# EAGLE design rpi-mcp3008 (EAGLE 6.5.0)
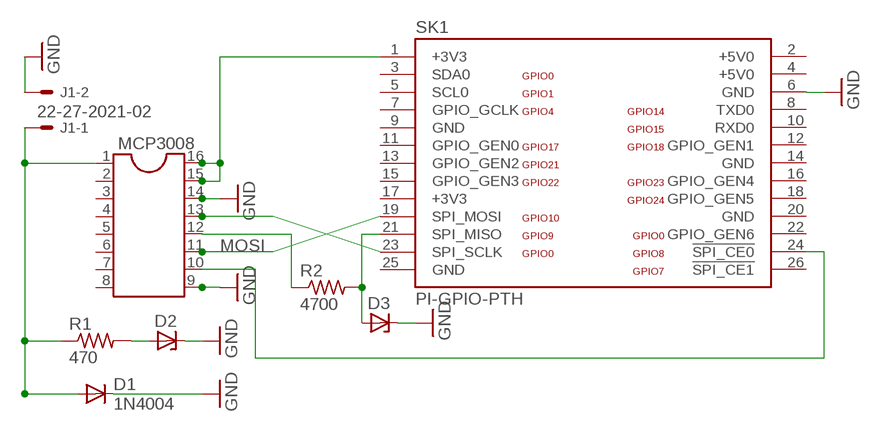
[diagram p0: schematic, sheet 1]

## Parts
D1  1N4004  [DO41-10]
D2  ZENER-DIODEP1-Z12  [P1Z12]
D3  ZENER-DIODEP1-Z12  [P1Z12]
J1  22-27-2021-02  [6410-02]
MCP3008  DIL16  [DIL16]
R1  470  R-US_0207/7  [0207/7]
R2  4700  R-US_0207/7  [0207/7]
SK1  PI-GPIO-PTH  [GPIO-CONNECTOR]

## Nets
GND: D1.C D2.C D3.C J1.2 MCP3008.9 MCP3008.14 SK1.6(GND)
MOSI: MCP3008.11 SK1.19(SPI_MOSI)
N$2: D1.A J1.1 MCP3008.1 R1.1
N$4: MCP3008.15 MCP3008.16 SK1.1(+3V3)
N$7: MCP3008.10 SK1.24(!SPI_CE0)
N$11: D2.A R1.2
N$13: MCP3008.12 R2.1
N$14: D3.A R2.2 SK1.21(SPI_MISO)
SCLK: MCP3008.13 SK1.23(SPI_SCLK)
Unconnected: MCP3008.2 MCP3008.3 MCP3008.4 MCP3008.5 MCP3008.6 MCP3008.7 MCP3008.8 SK1.3(SDA0) SK1.5(SCL0) SK1.7(GPIO_GCLK) SK1.8(TXD0) SK1.10(RXD0) SK1.11(GPIO_GEN0) SK1.12(GPIO_GEN1) SK1.13(GPIO_GEN2) SK1.15(GPIO_GEN3) SK1.16(GPIO_GEN4) SK1.18(GPIO_GEN5) SK1.22(GPIO_GEN6) SK1.26(!SPI_CE1)

## Power pins joined to a net without a drawn wire
+3V3: SK1.17(+3V3)
+5V0: SK1.2(+5V0) SK1.4(+5V0)
GND: SK1.9(GND) SK1.14(GND) SK1.20(GND) SK1.25(GND)

## Library data of the parts
D1 = diode:1N4004: DIODE general purpose rectifier, 1 A
D2 D3 = diode:ZENER-DIODE: Z-Diode
J1 = con-molex:22-?-02: CONNECTOR wire to board 2.54 mm (.1 inch) pitch header; OC_FARNELL: unknown; OC_NEWARK: unknown
MCP3008 = ic-package:DIL16: Dual In Line / Socket
R1 R2 = resistor:R-US_: RESISTOR, American symbol
SK1 = jt-raspberry-pi:PI-: Raspberry Pi

## Net classes
0 default: width 1.016 mm, clearance 0.355 mm
1 power: width 1 mm, clearance 0.355 mm to class 0, clearance 0.355 mm

## Board
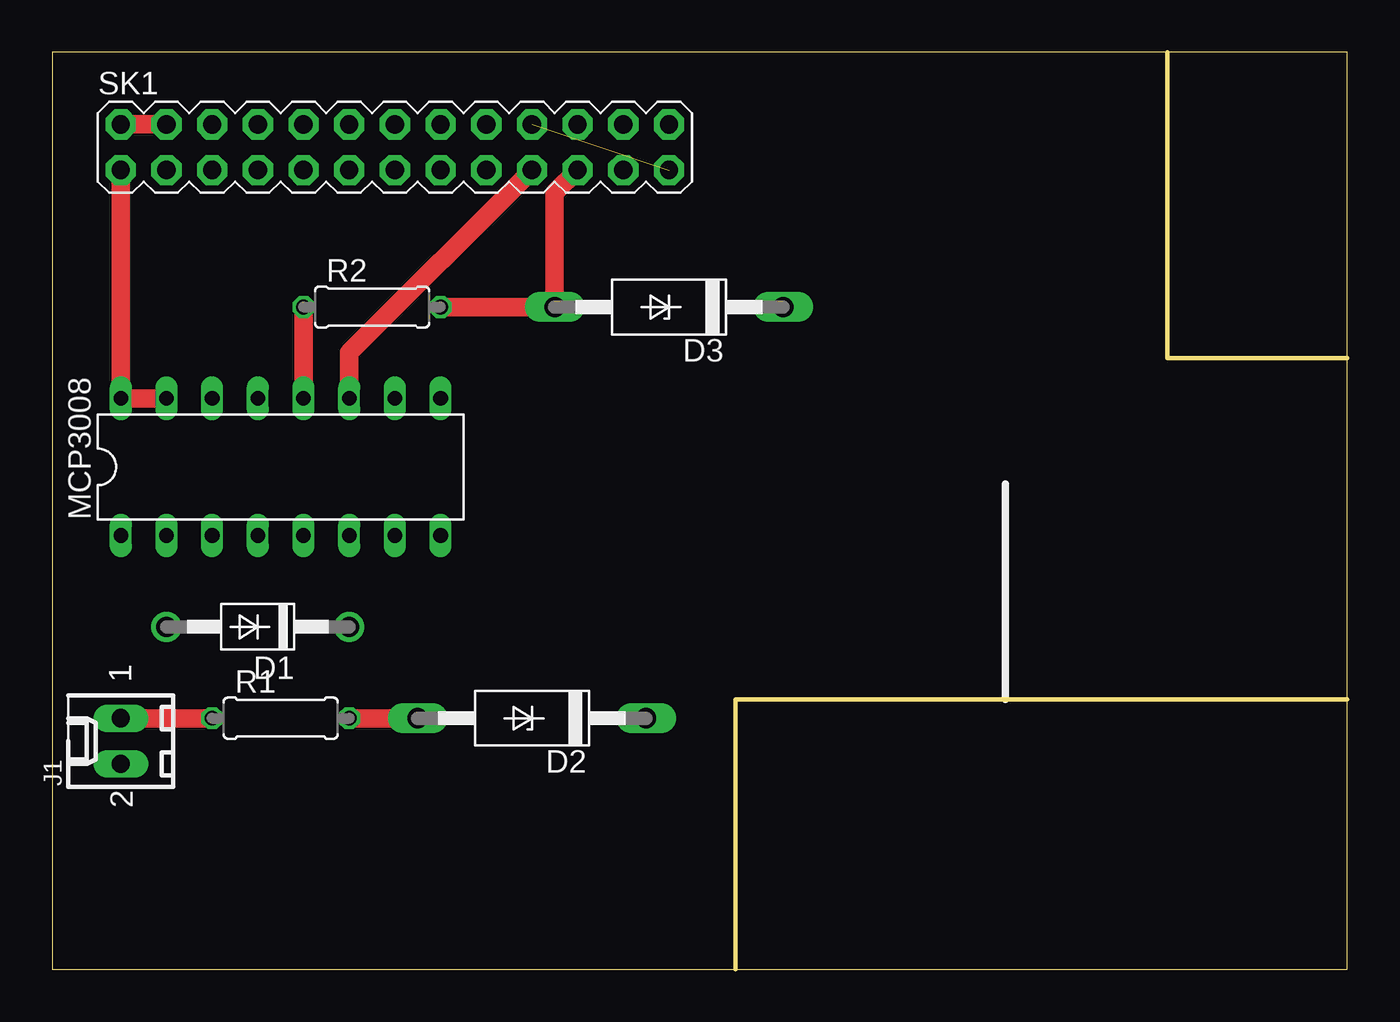
[diagram p1: board, top side]
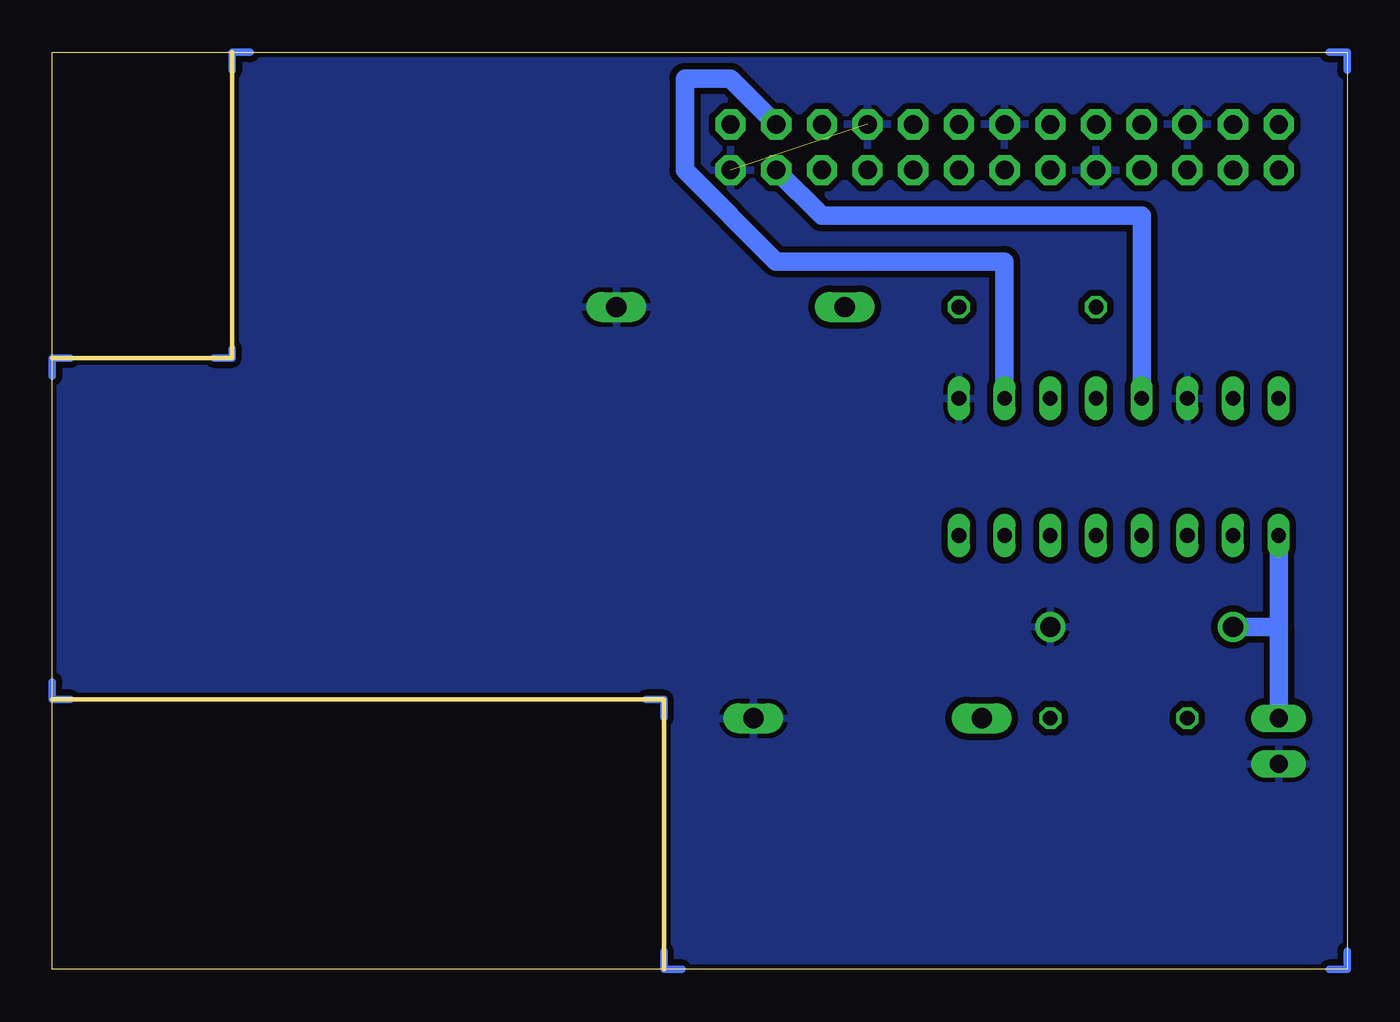
[diagram p2: board, bottom side, seen from below]

Size 72 x 51 mm. Coordinates in mm from the lower left corner, seen from the top.
Outline: 38,0 72,0 72,15
Outline: 72,15 72,34
Outline: 72,34 72,51 62,51
Outline: 62,51 0,51 0,0 38,0
Outline: 62,51 62,34 72,34
Outline: 38,0 38,15 72,15
Copper layers (1*2*15*16): Top 0.035mm / dielectric 0.2mm / layer 2 0.0175mm / dielectric 1.1mm / layer 15 0.0175mm / dielectric 0.2mm / Bottom 0.035mm
Design rules "SeeedStudio_DRU_no_angle_20130527": minimum track width 6mil, minimum drill 12mil, track to track 6mil, track to pad 6mil, pad to pad 6mil, via to via 6mil, smd to smd 0mil, copper to edge 10mil, drill to drill 10mil, minimum pad ring 6mil, minimum via ring 6mil, stop-mask expansion 2mil, vias tented up to drill 25mil, thermal gap 10mil

### Footprints (pad centres in the part's own frame; a part is rotated, then mirrored left to right if it is on the bottom)
DO41-10 = drill 1.118: A 5.08,0; C -5.08,0
P1Z12 = drill 1.118 long: A 6.35,0; C -6.35,0
6410-02 = drill 1.016 long: 1 1.27,0; 2 -1.27,0
DIL16 = drill 0.813 long: 1 -8.89,-3.81; 2 -6.35,-3.81; 3 -3.81,-3.81; 4 -1.27,-3.81; 5 1.27,-3.81; 6 3.81,-3.81; 7 6.35,-3.81; 8 8.89,-3.81; 9 8.89,3.81; 10 6.35,3.81; 11 3.81,3.81; 12 1.27,3.81; 13 -1.27,3.81; 14 -3.81,3.81; 15 -6.35,3.81; 16 -8.89,3.81
0207/7 = drill 0.813 octagon: 1 -3.81,0; 2 3.81,0
GPIO-CONNECTOR = drill 1.016 pad 1.676 octagon: 1 -15.24,-1.27; 2 -15.24,1.27; 3 -12.7,-1.27; 4 -12.7,1.27; 5 -10.16,-1.27; 6 -10.16,1.27; 7 -7.62,-1.27; 8 -7.62,1.27; 9 -5.08,-1.27; 10 -5.08,1.27; 11 -2.54,-1.27; 12 -2.54,1.27; 13 0,-1.27; 14 0,1.27; 15 2.54,-1.27; 16 2.54,1.27; 17 5.08,-1.27; 18 5.08,1.27; 19 7.62,-1.27; 20 7.62,1.27; 21 10.16,-1.27; 22 10.16,1.27; 23 12.7,-1.27; 24 12.7,1.27; 25 15.24,-1.27; 26 15.24,1.27

### Placement (x,y rotation side)
D1  11.43,19.05 180 top
D2  26.67,13.97 180 top
D3  34.29,36.83 180 top
J1  3.81,12.7 90 top
MCP3008  12.7,27.94 0 top
R1  12.7,13.97 0 top
R2  17.78,36.83 0 top
SK1  19.05,45.72 0 top

### Tracks (layer width: path | path; a pad name or v marks a point on that pad's centre or on a via)
+5V0
  Top 1.016: SK1.4 SK1.2
GND  (1 unrouted)
  pour Bottom: -2.54,53.34 74.93,53.34 74.93,-2.54 -2.54,-2.54
MOSI
  Top 1.016: MCP3008.11 16.51,34.29 SK1.19
N$1
  Bottom 0.406: 1,51 0,51 0,50
N$2
  Top 1.016: J1.1 R1.1
  Bottom 1.016: 3.81,19.05 MCP3008.1 | D1.A 3.81,19.05 | 3.81,19.05 J1.1
N$3
  Bottom 0.406: 0,1 0,0 1,0
N$4
  Top 1.016: MCP3008.15 MCP3008.16 SK1.1
N$5
  Bottom 0.406: 37,0 38,0 38,1
N$6
  Bottom 0.406: 38,14 38,15 39,15
N$7
  Bottom 1.016: MCP3008.10 19.05,39.37 31.75,39.37 36.83,44.45 36.83,49.53 34.29,49.53 SK1.24
N$8
  Bottom 0.406: 71,15 72,15 72,16
N$9
  Bottom 0.406: 71,34 72,34 72,33
N$10
  Bottom 0.406: 63,34 62,34 62,34.5
N$11
  Top 1.016: D2.A R1.2
N$12
  Bottom 0.406: 61,51 62,51 62,50
N$13
  Top 1.016: R2.1 MCP3008.12
N$14
  Top 1.016: R2.2 D3.A 27.94,43.18 SK1.21
SCLK
  Bottom 1.016: MCP3008.13 11.43,41.91 29.21,41.91 SK1.23